# Altium schematic sheet CH9329_2023-01-14.schdoc
size 62 x 50 mm
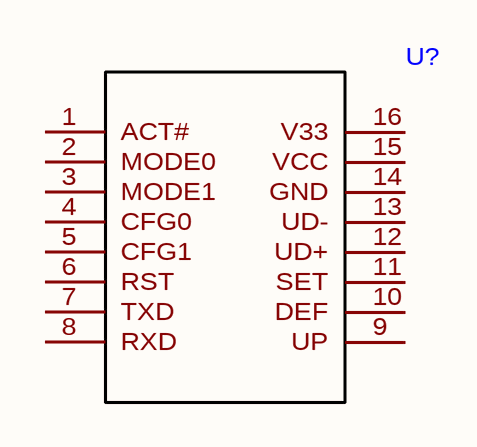
[diagram p0: CH9329_2023-01-14.schdoc]

## Parts
U?  (no value)  [SOP-16_150MILCH9328]

## Nets

Not connected (* = marked no-connect by the designer): U? 1(ACT#) 2(MODE0) 3(MODE1) 4(CFG0) 5(CFG1) 6(RST) 7(TXD) 8(RXD) 9(UP) 10(DEF) 11(SET) 12(UD+) 13(UD-) 14(GND) 15(VCC) 16(V33)

## Library data of the parts
U? = CH9329